# EAGLE design Adafruit MCP9600 (EAGLE 9.3.2)
COMPANY: Adafruit Industries; DRAWN: KTOWN; REV: A; YEAR: 2019
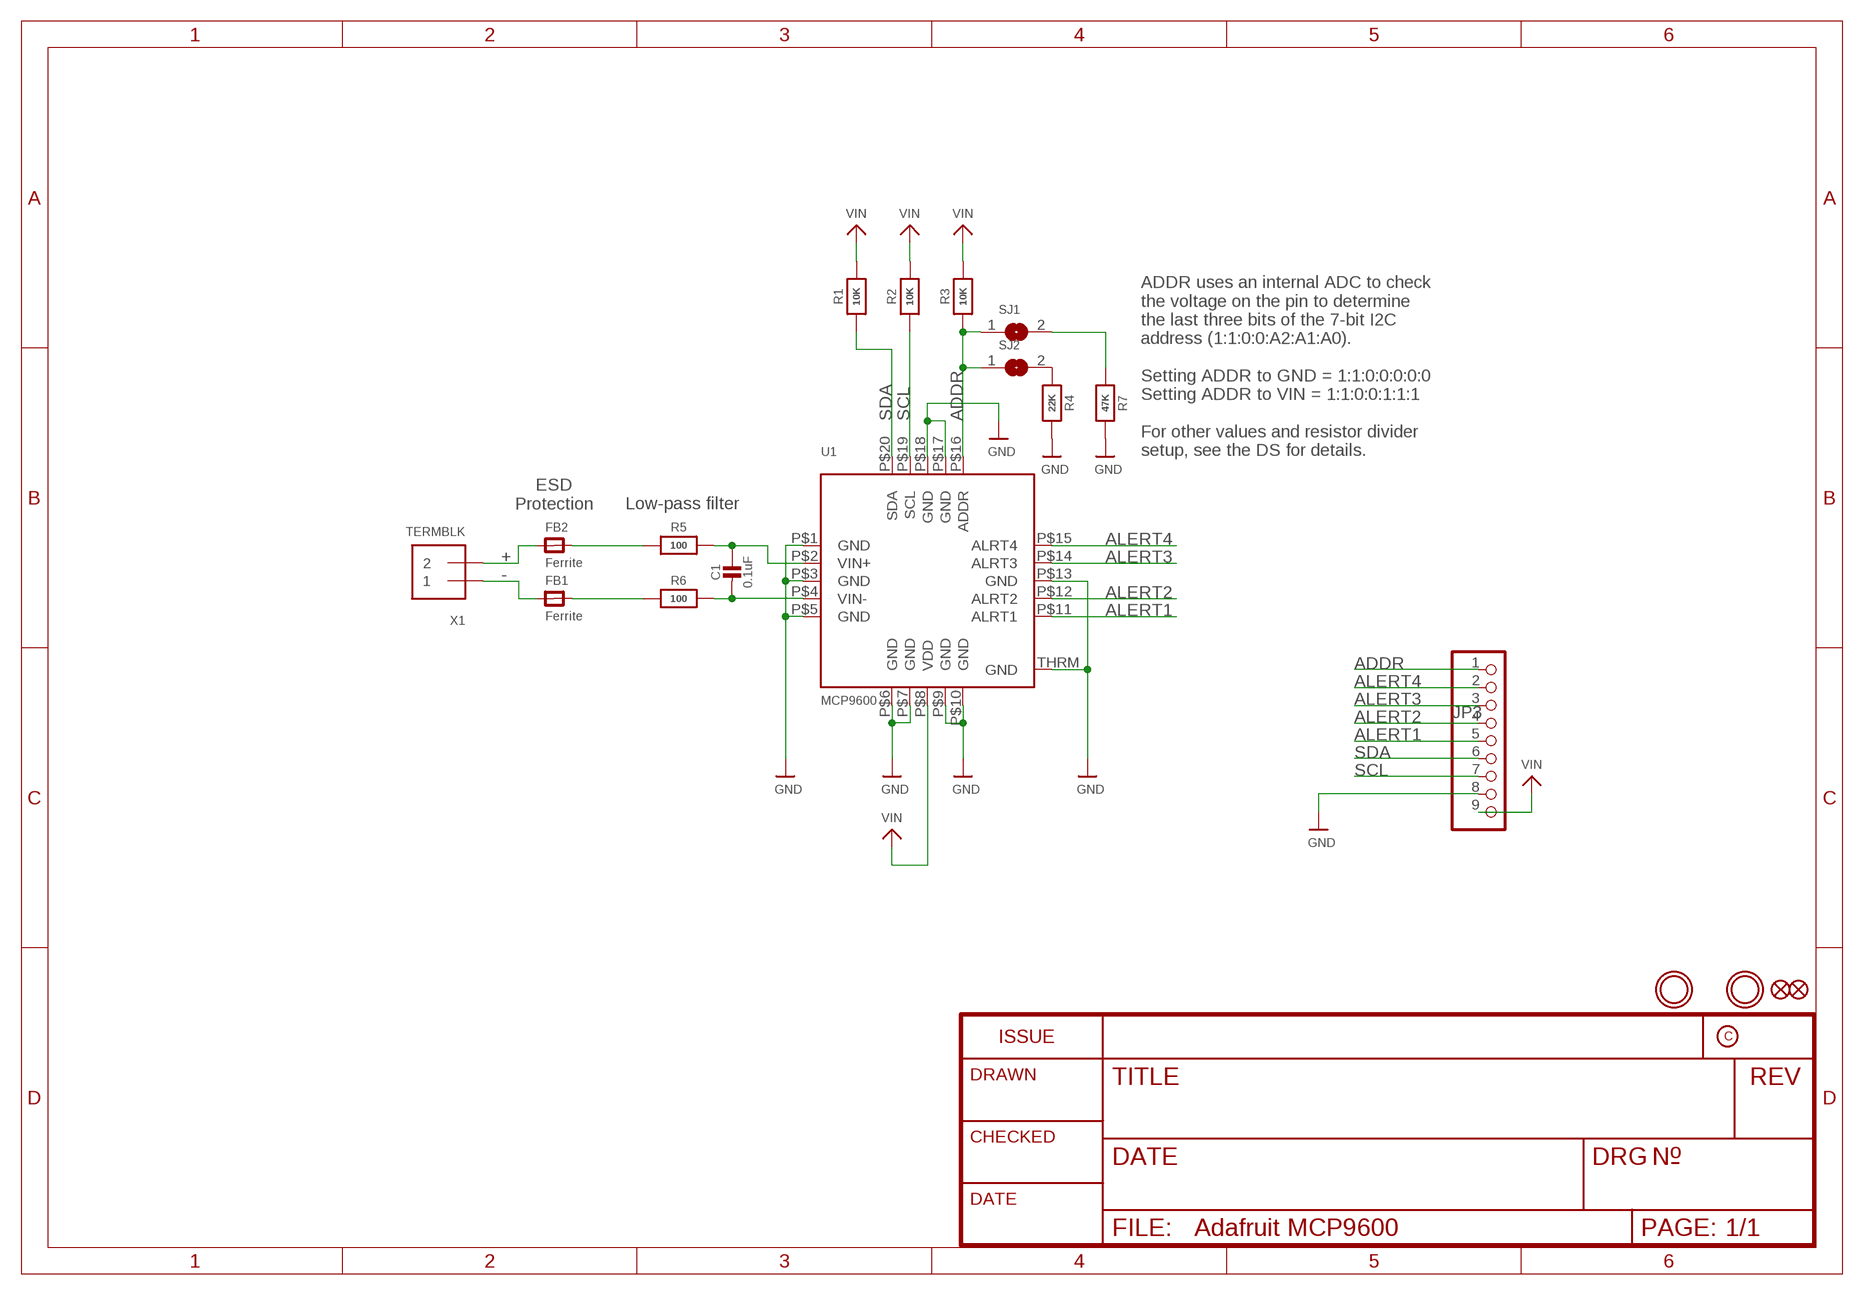
[diagram p0: schematic, sheet 1]

## Parts
C1  0.1uF  CAP_CERAMIC0603_NO  [0603-NO]
FB1  Ferrite  FERRITE-0805NO  [0805-NO]
FB2  Ferrite  FERRITE-0805NO  [0805-NO]
FID1  FIDUCIAL_1MM  [FIDUCIAL_1MM]
FID2  FIDUCIAL_1MM  [FIDUCIAL_1MM]
JP3  HEADER-1X970MIL  [1X09_ROUND_70]
R1  10K  RESISTOR_0603_NOOUT  [0603-NO]
R2  10K  RESISTOR_0603_NOOUT  [0603-NO]
R3  10K  RESISTOR_0603_NOOUT  [0603-NO]
R4  22K  RESISTOR_0603_NOOUT  [0603-NO]
R5  100  RESISTOR_0603_NOOUT  [0603-NO]
R6  100  RESISTOR_0603_NOOUT  [0603-NO]
R7  47K  RESISTOR_0603_NOOUT  [0603-NO]
SJ1  SOLDERJUMPER  [SOLDERJUMPER_ARROW_NOPASTE]
SJ2  SOLDERJUMPER  [SOLDERJUMPER_ARROW_NOPASTE]
U1  MCP9600  [VQFN20_5MM]
U$1  MOUNTINGHOLE2.5  [MOUNTINGHOLE_2.5_PLATED]
U$3  MOUNTINGHOLE2.5  [MOUNTINGHOLE_2.5_PLATED]
X1  TERMBLK  TERMBLOCK_1X2_3.5MM  [TERMBLOCK_1X2-3.5MM]

## Nets
+: FB2.1 X1.2
-: FB1.1 X1.1
ADDR: JP3.1 R3.1 SJ1.1 SJ2.1 U1.P$16(ADDR)
ALERT1: JP3.5 U1.P$11(ALRT1)
ALERT2: JP3.4 U1.P$12(ALRT2)
ALERT3: JP3.3 U1.P$14(ALRT3)
ALERT4: JP3.2 U1.P$15(ALRT4)
GND: JP3.8 R4.2 R7.2 U1.P$1(GND) U1.P$3(GND) U1.P$5(GND) U1.P$6(GND) U1.P$7(GND) U1.P$9(GND) U1.P$10(GND) U1.P$13(GND) U1.P$17(GND) U1.P$18(GND) U1.THRM(GND)
N$1: C1.1 R5.2 U1.P$2(VIN+)
N$3: C1.2 R6.2 U1.P$4(VIN-)
N$4: FB1.2 R6.1
N$6: FB2.2 R5.1
N$7: R7.1 SJ1.2
N$8: R4.1 SJ2.2
SCL: JP3.7 R2.1 U1.P$19(SCL)
SDA: JP3.6 R1.1 U1.P$20(SDA)
VIN: JP3.9 R1.2 R2.2 R3.2 U1.P$8(VDD)

## Notes on the sheet
- ADDR uses an internal ADC to check
  the voltage on the pin to determine
  the last three bits of the 7-bit I2C
  address (1:1:0:0:A2:A1:A0).
  
  Setting ADDR to GND = 1:1:0:0:0:0:0
  Setting ADDR to VIN = 1:1:0:0:1:1:1
  
  For other values and resistor divider
  setup, see the DS for details.
- ESD
  Protection
- Low-pass filter

## Library data of the parts
C1 = microbuilder:CAP_CERAMIC: Ceramic Capacitors For new designs, use the packages preceded by an '_' character since they are more reliable: The following footprints should be used on most boards: _0402 - Standard footprint for regular board layouts _0603 - Standard footprint for regular board layouts _0805 - Standard footprint for regular board layouts _1206 - Standard footprint for regular board layouts For extremely tight-pitch boards where space is at a premium, the following 'micro-pitch' footprints can be used (smaller pads, no silkscreen outline, etc.): _0402MP - Micro-pitch footprint for very dense/compact boards _0603MP - Micro-pitch footprint for very dense/compact boards _0805MP - Micro-pitch footprint for very dense/compact boards _1206MP - Micro-pitch footprint for very dense/compact boards
FB1 FB2 = microbuilder:FERRITE: Ferrite Bead 0603 MMZ1608B121C - 120 Ohm @ 100MHz, 600mA, 0.15 Ohm DC Resistance - Digikey: 445-2164-1-ND BK1608HW121-T - 120 Ohm, 600mA Ferrite Chip - Digikey: 587-1876-2-ND 0805 HZ0805B272R-10 - 2.7K Ohm @ 100MHz, 200mA, 0.8 Ohm DC Resistance - Digikey: 240-2504-1-ND (see also Murata BLM21BD272SN1L) MMZ2012Y152B - 1.5K Ohm @ 100MHz, 500mA, 0.4 Ohm DC Resistance - Digikey: 445-1560-1-ND - Mainly for high frequency (80-400MHz) MMZ2012R102A - 1K Ohm @ 100MHz, 500mA, 0.3 Ohm DC Resistance - Digikey: 445-1555-2-ND - More general purpose (10-200MHz)
FID1 FID2 = microbuilder:FIDUCIAL: Fiducial Alignment Points Various fiducial points for machine vision alignment.; BOM: EXCLUDE
JP3 = microbuilder:HEADER-1X9: PIN HEADER
R1-R7 = microbuilder:RESISTOR: Resistors For new designs, use the packages preceded by an '_' character since they are more reliable: The following footprints should be used on most boards: _0402 - Standard footprint for regular board layouts _0603 - Standard footprint for regular board layouts _0805 - Standard footprint for regular board layouts _1206 - Standard footprint for regular board layouts For extremely tight-pitch boards where space is at a premium, the following 'micro-pitch' footprints can be used (smaller pads, no silkscreen outline, etc.): _0402MP - Micro-pitch footprint for very dense/compact boards _0603MP - Micro-pitch footprint for very dense/compact boards _0805MP - Micro-pitch footprint for very dense/compact boards _1206MP - Micro-pitch footprint for very dense/compact boards
SJ1 SJ2 = microbuilder:SOLDERJUMPER: SMD Solder JUMPER Solder the two pads together to create a connection, or remove the solder to break it. REFLOW - Use this footprint for solder paste and reflow ovens. WAVE - Use this footprint for hand-soldering (larger pads). CLOSED - Has a trace between the two pads to ensure it is closed by default. The trace needs to be cut to disable the jumper, and can be closed again by creating a solder bridge between the two pads.; BOM: EXCLUDE
U1 = microbuilder:MCP9600: MCP9600 - I2C Thermocouple EMF to Temperature Converter Operating Voltage Range: 2.7V to 5.5V
U$1 U$3 = microbuilder:MOUNTINGHOLE: Mounting Hole For #2 screws (0.086"/2.18mm width, 0.094"/2.4mm hole) use 2.5mm; BOM: EXCLUDE
X1 = microbuilder:TERMBLOCK_1X2: 3.5mm Terminal block http://www.ladyada.net/library/pcb/eaglelibrary.html

## Board
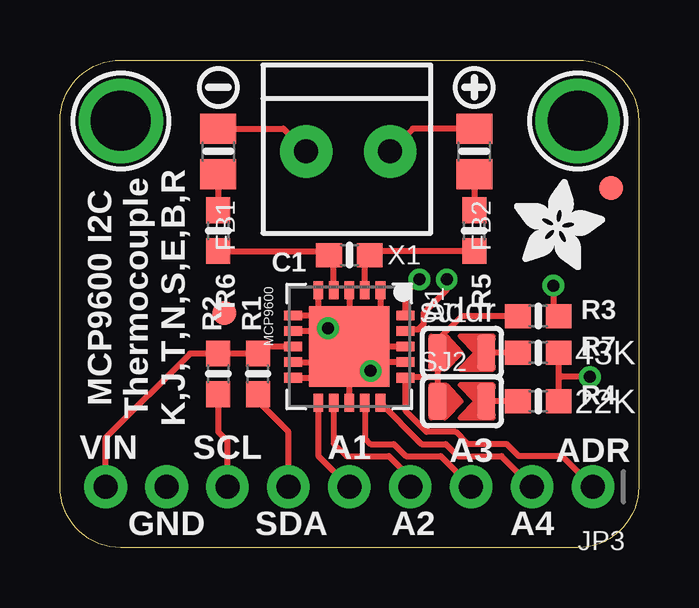
[diagram p1: board, top side]
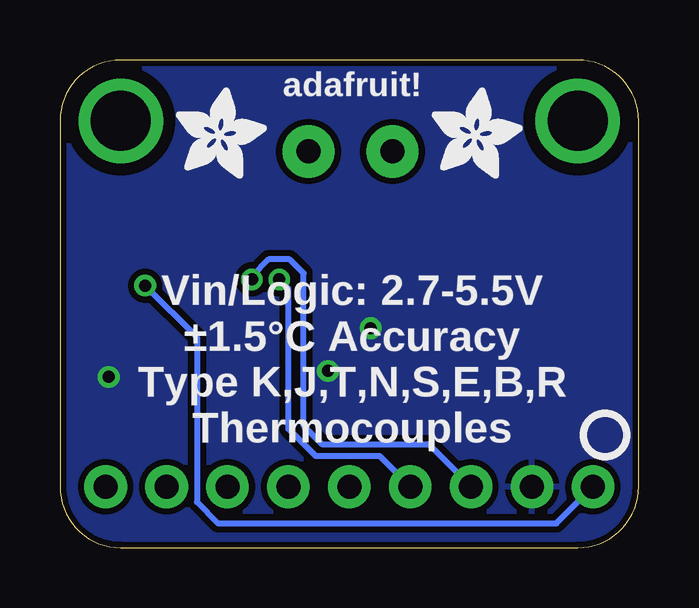
[diagram p2: board, bottom side, seen from below]

Size 24.13 x 20.32 mm. Coordinates in mm from the lower left corner, seen from the top.
Outline: 24.13,17.78 24.13,2.54 arc-90 21.59,0 2.54,0 arc-90 0,2.54 0,17.78 arc-90 2.54,20.32 21.59,20.32 arc-90 24.13,17.78
Copper layers (1*16): Top 0.035mm / dielectric 1.5mm / Bottom 0.035mm
Design rules "adafruit *": minimum track width 8mil, minimum drill 15.5mil, track to track 10mil, track to pad 10mil, pad to pad 8mil, via to via 8mil, smd to smd 8mil, copper to edge 10mil, drill to drill 8mil, minimum pad ring 10mil, minimum via ring 8mil, stop-mask expansion 2mil, vias tented up to drill 20mil, thermal gap 10mil

### Footprints (pad centres in the part's own frame; a part is rotated, then mirrored left to right if it is on the bottom)
0603-NO = smd 1.075 x 1: 1 -0.85,0; 2 0.85,0
0805-NO = smd 1.24 x 1.5: 1 -0.95,0; 2 0.95,0
FIDUCIAL_1MM = smd 1 x 1: 1 0,0
1X09_ROUND_70 = drill 1 pad 1.778: 1 -10.16,0; 2 -7.62,0; 3 -5.08,0; 4 -2.54,0; 5 0,0; 6 2.54,0; 7 5.08,0; 8 7.62,0; 9 10.16,0
SOLDERJUMPER_ARROW_NOPASTE = smd 0.762 x 1.524: 1 -1.016,0; 2 1.016,0
VQFN20_5MM = smd 0.75 x 0.4: P$1 -2.35,1.3; P$2 -2.35,0.65; P$3 -2.35,0; P$4 -2.35,-0.65; P$5 -2.35,-1.3; P$11 2.35,-1.3; P$12 2.35,-0.65; P$13 2.35,0; P$14 2.35,0.65; P$15 2.35,1.3 | smd 0.4 x 0.75: P$6 -1.3,-2.35; P$7 -0.65,-2.35; P$8 0,-2.35; P$9 0.65,-2.35; P$10 1.3,-2.35; P$16 1.3,2.35; P$17 0.65,2.35; P$18 0,2.35; P$19 -0.65,2.35; P$20 -1.3,2.35 | smd 3.35 x 3.35: THRM 0,0
MOUNTINGHOLE_2.5_PLATED = drill 2.5 pad 3.2: P$1 0,0
TERMBLOCK_1X2-3.5MM = drill 1 pad 2.184: 1 1.8,0; 2 -1.7,0

### Placement (x,y rotation side)
C1  12.06,12.19 180 top
FB1  6.6,16.51 270 top
FB2  17.27,16.51 270 top
FID1  22.99,14.99 180 top
FID2  6.86,9.78 180 top
JP3  12.06,2.54 180 top
R1  8.26,7.24 90 top
R2  6.6,7.24 90 top
R3  19.94,9.65 0 top
R4  19.94,6.1 0 top
R5  17.27,13.21 270 top
R6  6.6,13.21 270 top
R7  19.94,8.13 0 top
SJ1  16.76,8.13 0 top
SJ2  16.76,6.1 0 top
U1  12.06,8.38 270 top
U$1  21.59,17.78 180 top
U$3  2.54,17.78 180 top
U$16  [ADAFRUIT_3.5MM]  18.92,11.56 0 top
U$17  [SYMBOL_PLUS]  17.27,19.18 0 top
U$18  [SYMBOL_MINUS]  6.6,19.18 0 top
U$19  [ADAFRUIT_3.5MM]  8.64,15.37 0 bottom
U$20  [ADAFRUIT_3.5MM]  19.3,15.37 0 bottom
U$21  [PCBFEAT-REV-040]  1.4,4.7 0 bottom
X1  12.06,16.51 180 top

### Tracks (layer width: path | path; a pad name or v marks a point on that pad's centre or on a via)
+
  Top 0.254: FB2.1 14.71,17.46 X1.2
-
  Top 0.254: FB1.1 9.31,17.46 X1.1
ADDR
  Top 0.254: JP3.1 20.95,3.81 19.13,3.81 18.62,4.32 17.02,4.32 16.51,4.83 15.29,4.83 14.41,5.7 U1.P$16 14.45,7.11 15.75,7.11 | 15.75,7.11 SJ1.1 15.75,8.64 16.76,9.65 R3.1 | 15.75,7.11 SJ2.1
ALERT1
  Top 0.254: U1.P$11 10.77,3.84 JP3.5
ALERT2
  Top 0.254: U1.P$12 11.41,4.33 11.94,3.81 13.72,3.81 14.61,2.92 JP3.4
ALERT3
  Top 0.254: U1.P$14 12.71,4.56 12.95,4.32 13.93,4.32 14.43,3.81 15.88,3.81 JP3.3
ALERT4
  Top 0.254: U1.P$15 15.08,4.32 16.09,4.32 16.59,3.81 18.41,3.81 JP3.2
GND  (via drill 0.5)
  Top 0.254: U1.P$3 12.06,8.64 | 12.06,8.64 U1.THRM | U1.P$10 10.77,7.08 11.41,7.73 | U1.P$9 11.41,7.73 | 11.41,7.73 11.87,8.19 | 11.87,8.19 12,8.32 | 12,8.32 U1.THRM | U1.P$7 11.41,9.03 | U1.P$6 11.02,9.68 12.06,8.64 | U1.P$13 12.06,8 11.87,8.19 | U1.P$17 12.59,7.73 12,8.32 | U1.P$18 12.7,8.38 | 12.7,8.38 U1.THRM | U1.P$1 13.37,9.05 12.7,8.38 | U1.P$5 10.77,9.68 11.41,9.03 | U1.THRM 11.41,9.03 | U1.THRM 11.94,8.38 v11.18,9.14 | R4.2 R7.2 20.79,7.24 20.92,7.11 v22.1,7.11
  other vias: 12.95,7.37
  pour Bottom (isolate 0.254): 0,2.54 0,17.78 arc-90 2.54,20.32 21.59,20.32 arc-90 24.13,17.78 24.13,2.54 arc-90 21.59,0 2.54,0 arc-90
N$1
  Top 0.254: R5.2 13.08,12.36 C1.1 12.71,11.99 U1.P$2
N$3
  Top 0.254: R6.2 11.05,12.36 C1.2 11.41,11.99 U1.P$4
N$4
  Top 0.254: FB1.2 R6.1
N$6
  Top 0.254: FB2.2 R5.1
N$7
  Top 0.254: R7.1 SJ1.2
N$8
  Top 0.254: R4.1 SJ2.2
SCL  (via drill 0.5)
  Top 0.254: JP3.7 6.99,4.45 6.6,4.83 R2.1 | v16.13,11.18 16.13,10.75 15.17,9.79 15.17,9.32 14.95,9.1 14.48,9.1 U1.P$19
  Bottom 0.254: v16.13,11.18 16.13,11.3 15.42,12.01 14.55,12.01 13.97,11.43 13.97,5.08 13.21,4.32 8.74,4.32 6.99,2.56 JP3.7
SDA  (via drill 0.5)
  Top 0.254: JP3.6 9.53,4.83 8.11,6.24 R1.1 | U1.P$20 14.41,10.61 v14.99,11.18
  Bottom 0.254: JP3.6 10.79,3.81 13.46,3.81 14.61,4.95 14.61,10.79 v14.99,11.18
VIN  (via drill 0.5)
  Top 0.254: U1.P$8 8.55,8.38 R1.2 R2.2 5.42,8.09 1.91,4.57 JP3.9 | R3.2 20.57,9.87 v20.57,10.92
  Bottom 0.254: v20.57,10.92 18.41,8.76 18.41,1.91 17.53,1.02 3.43,1.02 JP3.9

### Text on the board
tPlace: MCP9600 I2C / Thermocouple / K,J,T,N,S,E,B,R | Addr | 43K | 22K | VIN | SCL | A1 | A3 | ADR | GND | SDA | A2 | A4
bPlace: adafruit! | Vin/Logic: 2.7-5.5V / ±1.5°C Accuracy / Type K,J,T,N,S,E,B,R / Thermocouples